# EAGLE schematic AlmosFinalMC (EAGLE 7.5.0)
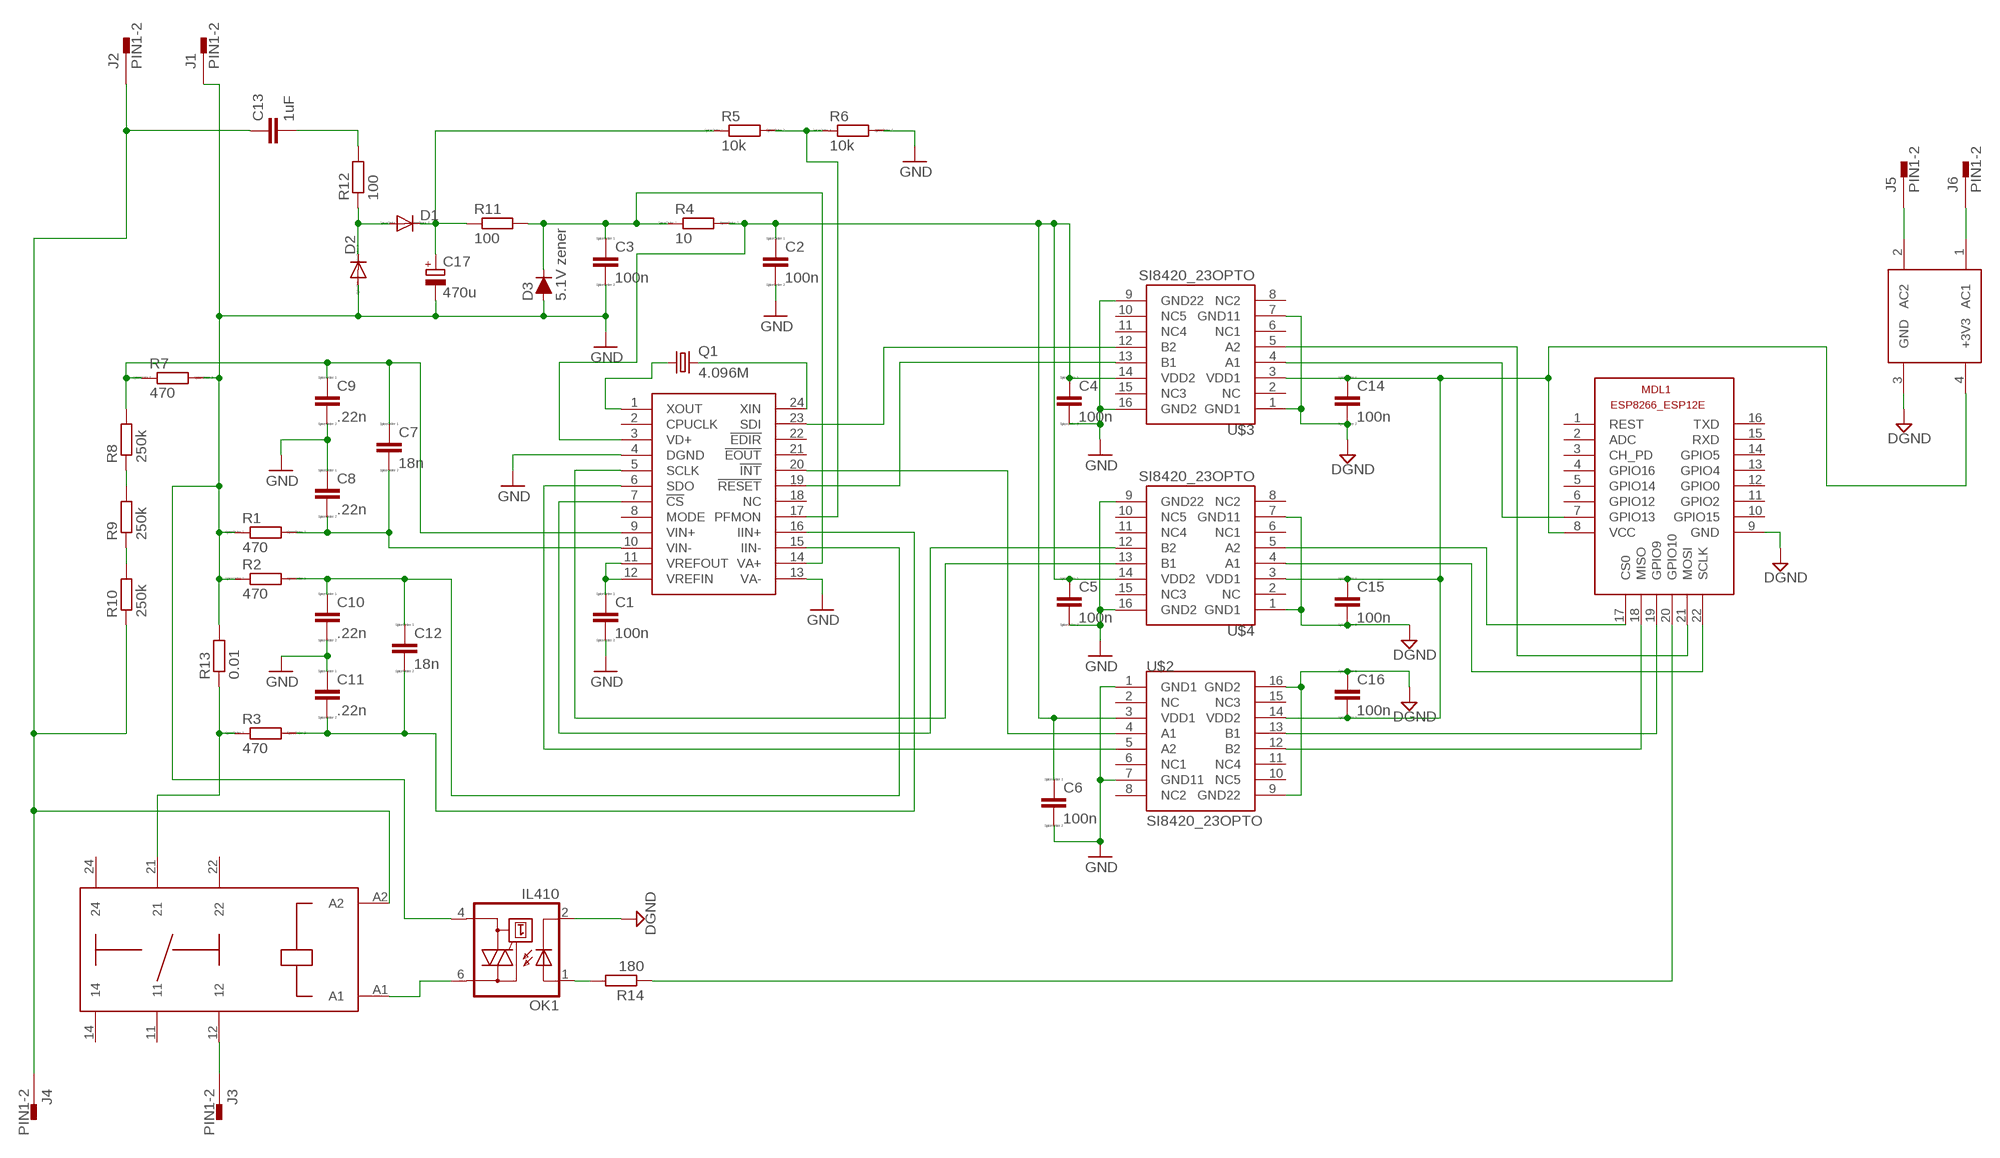
[diagram p0: schematic, sheet 1]

## Parts
C1  100n  C  [C0805]
C2  100n  C  [C0805]
C3  100n  C  [C0805]
C4  100n  C  [C0805]
C5  100n  C  [C0805]
C6  100n  C  [C0805]
C7  18n  C  [C0805]
C8  .22n  C  [C0805]
C9  .22n  C  [C0805]
C10  .22n  C  [C0805]
C11  .22n  C  [C0805]
C12  18n  C  [C0805]
C13  1uF  C-EU225-113X268  [C225-113X268]
C14  100n  C  [C0805]
C15  100n  C  [C0805]
C16  100n  C  [C0805]
C17  470u  CPOL-EUG  [PANASONIC_G]
D1  DIODE-DO-214AC  [DO-214AC]
D2  DIODE-DO-214AC  [DO-214AC]
D3  5.1V zener  D-FILL-SOD123  [SOD123]
J1  PIN1-2  [62221]
J2  PIN1-2  [62221]
J3  PIN1-2  [62221]
J4  PIN1-2  [62221]
J5  PIN1-2  [62221]
J6  PIN1-2  [62221]
MDL1  ESP8266-12EESP8266-ESP12E  [ESP8266-ESP12E]
OK1  IL410  [DIL06]
Q1  4.096M  CRYSTALHC49UP  [HC49UP]
R1  470  R  [R0805]
R2  470  R  [R0805]
R3  470  R  [R0805]
R4  10  R  [R0805]
R5  10k  R  [R0805]
R6  10k  R  [R0805]
R7  470  R  [R0805]
R8  250k  R-EU_0204/5  [0204/5]
R9  250k  R-EU_0204/5  [0204/5]
R10  250k  R-EU_0204/5  [0204/5]
R11  100  R-EU_0207/5V  [0207/5V]
R12  100  R-EU_0309/10  [0309/10]
R13  0.01  R-EU_RDH/15  [RDH/15]
R14  180  R-EU_R0805  [R0805]
U$1  CS5460A  [SSOP24]
U$2  SI8420_23OPTO  [SI8420-SOIC8WB]
U$3  SI8420_23OPTO  [SI8420-SOIC8WB]
U$4  SI8420_23OPTO  [SI8420-SOIC8WB]
U$5  RAC02  [RAC02]
U$6  FINDER40-61  [FINDER40-61]

## Nets
DGND: C14.2 C15.2 C16.1 MDL1.9(GND) OK1.2(C) U$2.9(GND22) U$2.16(GND2) U$3.1(GND1) U$3.7(GND11) U$4.1(GND1) U$4.7(GND11) U$5.3(GND)
GND: C1.2 C2.2 C3.2 C4.2 C5.2 C6.2 C8.1 C9.2 C10.2 C11.1 C17.- D2.A D3.2(A) J1.1 OK1.4(A1) R1.1 R2.1 R6.2 R7.2 R13.2 U$1.4(DGND) U$1.13(VA-) U$2.1(GND1) U$2.7(GND11) U$3.9(GND22) U$3.16(GND2) U$4.9(GND22) U$4.16(GND2)
N$1: C3.1 D3.1(C) R4.1 R11.2 U$1.14(VA+)
N$2: C2.1 C4.1 C5.1 C6.1 R4.2 U$1.3(VD+) U$2.3(VDD1) U$3.14(VDD2) U$4.14(VDD2)
N$3: R5.2 R6.1 U$1.17(PFMON)
N$4: C7.1 C9.1 R7.1 R8.2 U$1.9(VIN+)
N$5: U$1.23(SDI) U$3.12(B2)
N$6: C7.2 C8.2 R1.2 U$1.10(VIN-)
N$7: C17.+ D1.C R5.1 R11.1
N$8: D1.A D2.C R12.1
N$10: C10.1 C12.1 R2.2 U$1.15(IIN-)
N$11: C11.2 C12.2 R3.2 U$1.16(IIN+)
N$13: C1.1 U$1.11(VREFOUT) U$1.12(VREFIN)
N$14: U$1.20(!INT!) U$2.4(A1)
N$15: U$1.6(SDO) U$2.5(A2)
N$16: R3.1 R13.1 U$6.21
N$17: C13.1 J2.1 J4.1 R10.1 U$6.A2
N$18: R8.1 R9.2
N$19: R9.1 R10.2
N$20: C13.2 R12.2
N$21: U$1.19(!RESET!) U$3.13(B1)
N$23: U$1.7(!CS!) U$4.12(B2)
N$24: U$1.5(SCLK) U$4.13(B1)
N$28: J5.1 U$5.2(AC2)
N$29: C14.1 C15.1 C16.2 MDL1.8(VCC) U$2.14(VDD2) U$3.3(VDD1) U$4.3(VDD1) U$5.4(+3V3)
N$30: J6.1 U$5.1(AC1)
N$31: Q1.1 U$1.1(XOUT)
N$32: Q1.2 U$1.24(XIN)
N$33: MDL1.22(SCLK) U$4.4(A1)
N$34: MDL1.17(CS0) U$4.5(A2)
N$35: OK1.1(A) R14.2
N$36: MDL1.21(MOSI) U$3.5(A2)
N$37: MDL1.20(GPIO10) R14.1
N$38: MDL1.18(MISO) U$2.12(B2)
N$39: MDL1.19(GPIO9) U$2.13(B1)
N$40: MDL1.7(GPIO13) U$3.4(A1)
N$41: J3.1 U$6.12
N$42: OK1.6(A2) U$6.A1
Unconnected: MDL1.1(REST) MDL1.2(ADC) MDL1.3(CH_PD) MDL1.4(GPIO16) MDL1.5(GPIO14) MDL1.6(GPIO12) MDL1.10(GPIO15) MDL1.11(GPIO2) MDL1.12(GPIO0) MDL1.13(GPIO4) MDL1.14(GPIO5) MDL1.15(RXD) MDL1.16(TXD) U$1.2(CPUCLK) U$1.8(MODE) U$1.18(NC) U$1.21(!EOUT!) U$1.22(!EDIR!) U$2.2(NC) U$2.6(NC1) U$2.8(NC2) U$2.10(NC5) U$2.11(NC4) U$2.15(NC3) U$3.2(NC) U$3.6(NC1) U$3.8(NC2) U$3.10(NC5) U$3.11(NC4) U$3.15(NC3) U$4.2(NC) U$4.6(NC1) U$4.8(NC2) U$4.10(NC5) U$4.11(NC4) U$4.15(NC3) U$6.11 U$6.14 U$6.22 U$6.24

## Library data of the parts
C1-C12 C14-C16 = eagle-ltspice:C: CAPACITOR, European symbol; SPICEMODEL: NONE; SPICEPREFIX: C
C13 = rcl:C-EU: CAPACITOR, European symbol
C17 = rcl:CPOL-EU: POLARIZED CAPACITOR, European symbol
D1 D2 = diode:DIODE-: DIODE
D3 = semicon-smd-ipc:D-FILL-: DIODE filled
J1-J6 = con-faston:PIN1-2: CONN TAB FASTON BRASS .187 PCB TAB, FSSTON, DUAL STAKE, .187 SERIES Digi-Key Part Number: A24734CT-ND Source: Tyco Electronics Corporation .. ENG_CD_62221_R.pdf http://search.digikey.com/scripts/DkSearch/dksus.dll?Detail&name=A24734CT-ND; MF: TYCO ELECTRONICS; MPN: 62221-1; OC_FARNELL: unknown; OC_NEWARK: 16H2318
MDL1 = ESP8266-ESP12E:ESP8266-12E: ESP8266-12E with additional I/O and GPIO04/05 corrected The author cannot warrant that this library is free from error or will meet your specific requirements. Created by PuceBaboon.com. Komagane, Nagano, JAPAN
OK1 = optocoupler:IL410: SIEMENS OPTO COUPLER; MF: VISHAY/TELEFUNKEN; MPN: IL410; OC_FARNELL: 1045434; OC_NEWARK: 58K1715
Q1 = crystal:CRYSTAL: CRYSTAL; OC_FARNELL: unknown; OC_NEWARK: unknown
R1-R7 = eagle-ltspice:R: RESISTOR, European symbol; SPICEMODEL: NONE; SPICEPREFIX: R
R8-R14 = resistor:R-EU_: RESISTOR, European symbol
U$1 = CS5460Apwr:CS5460A
U$2-U$4 = Si8420WB:SI8420_23OPTO
U$5 = RAC02:RAC02
U$6 = Finder40_61:FINDER40-61